# EAGLE design 控制电路 (EAGLE 6.4)
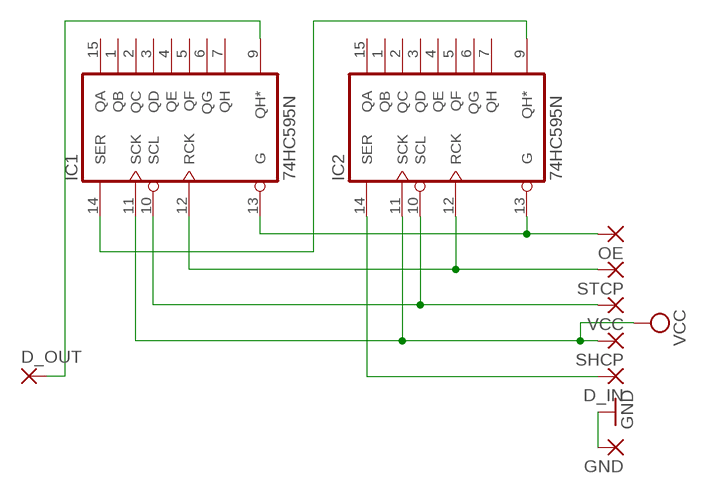
[diagram p0: schematic, sheet 1]

## Parts
D_IN  1,6/0,8  [1,6/0,8]
D_OUT  1,6/0,8  [1,6/0,8]
GND  1,6/0,8  [1,6/0,8]
IC1  74HC595N  [DIL16]
IC2  74HC595N  [DIL16]
OE  1,6/0,8  [1,6/0,8]
SHCP  1,6/0,8  [1,6/0,8]
STCP  1,6/0,8  [1,6/0,8]
VCC  1,6/0,8  [1,6/0,8]

## Nets
GND: GND.1(P)
N$1: IC1.13(G) IC2.13(G) OE.1(P)
N$2: IC1.12(RCK) IC2.12(RCK) STCP.1(P)
N$4: IC1.10(SCL) IC2.10(SCL) VCC.1(P)
N$5: IC1.14(SER) IC2.9(QH*)
N$6: D_IN.1(P) IC2.14(SER)
N$7: D_OUT.1(P) IC1.9(QH*)
VCC: IC1.11(SCK) IC2.11(SCK) SHCP.1(P)
Unconnected: IC1.1(QB) IC1.2(QC) IC1.3(QD) IC1.4(QE) IC1.5(QF) IC1.6(QG) IC1.7(QH) IC1.15(QA) IC2.1(QB) IC2.2(QC) IC2.3(QD) IC2.4(QE) IC2.5(QF) IC2.6(QG) IC2.7(QH) IC2.15(QA)

## Power pins joined to a net without a drawn wire
GND: IC1.8(GND) IC2.8(GND)
VCC: IC1.16(VCC) IC2.16(VCC)

## Library data of the parts
D_IN D_OUT GND OE SHCP STCP VCC = wirepad:1,6/0,8: THROUGH-HOLE PAD
IC1 IC2 = 74xx-eu:74*595: 8-bit SHIFT REGISTER, output latch

## Board
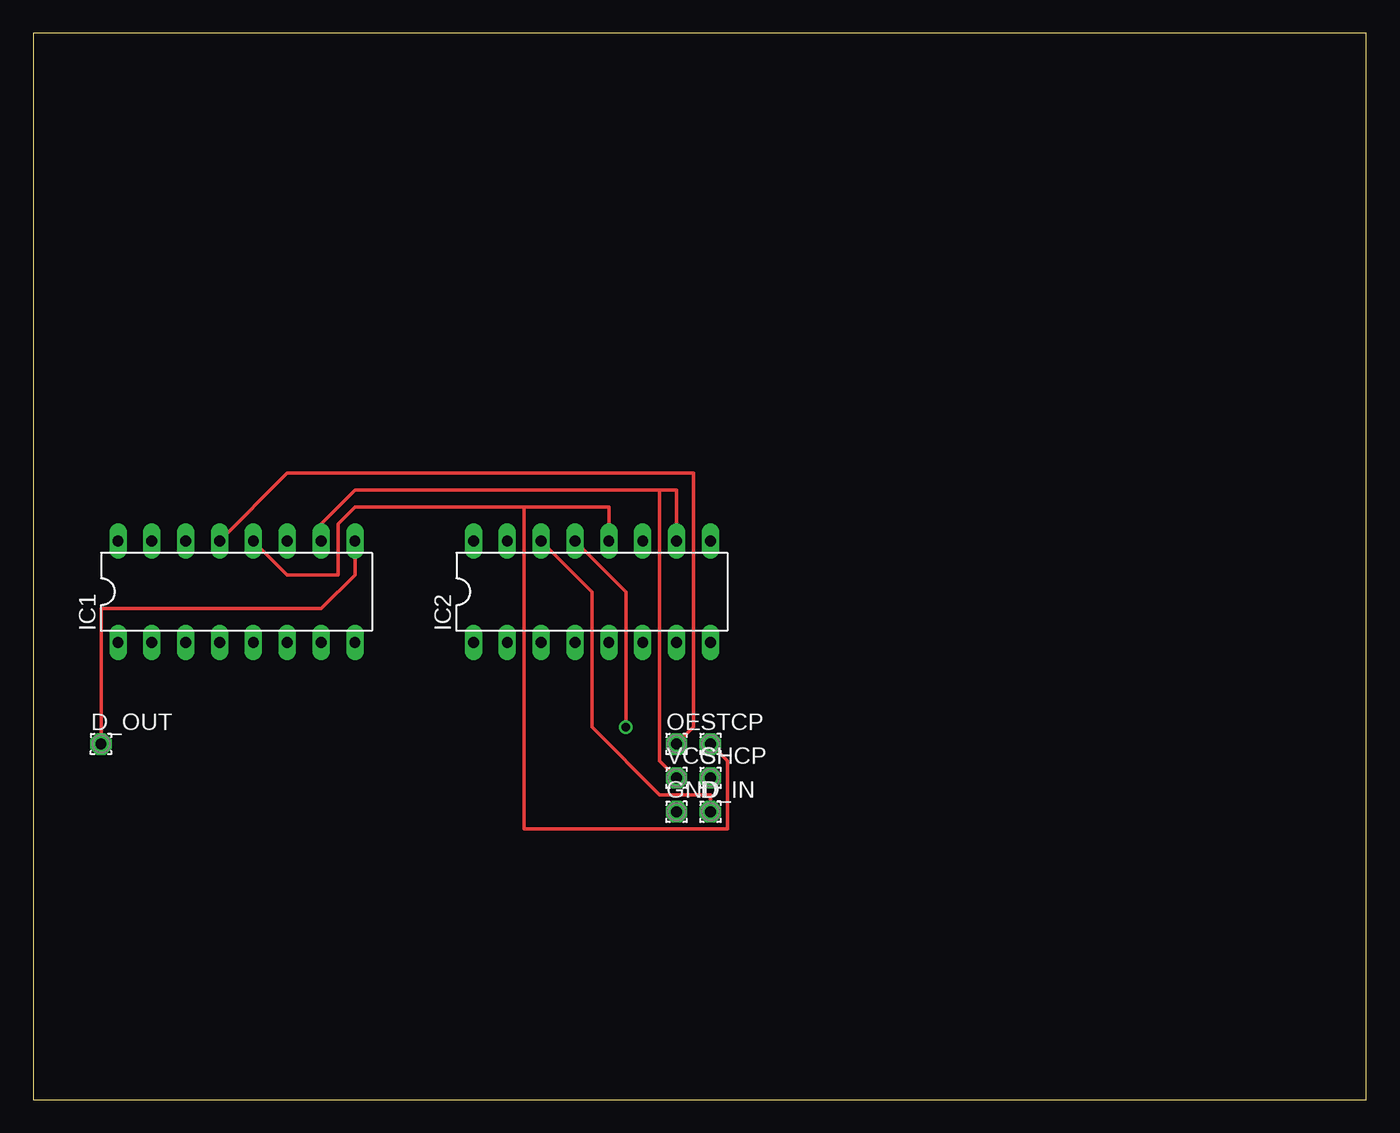
[diagram p1: board, top side]
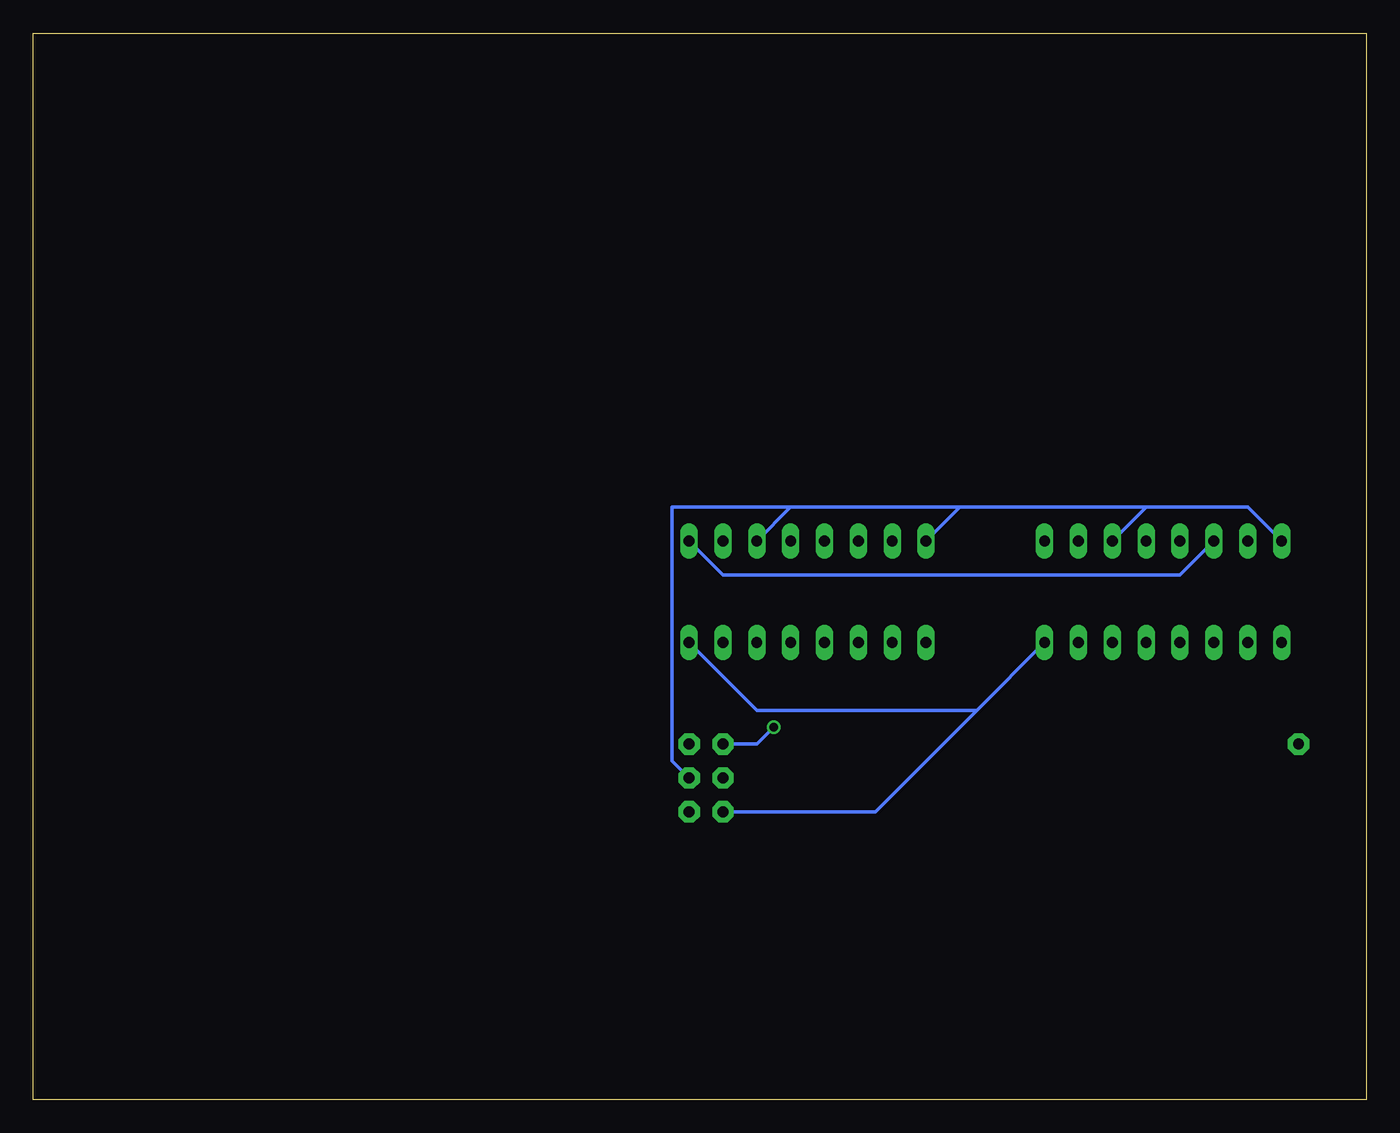
[diagram p2: board, bottom side, seen from below]

Size 100 x 80 mm. Coordinates in mm from the lower left corner, seen from the top.
Outline: 0,0 100,0 100,80 0,80 0,0
Copper layers (1*16): Top 0.035mm / dielectric 1.5mm / Bottom 0.035mm
Design rules "default": minimum track width 10mil, minimum drill 24mil, track to track 8mil, track to pad 8mil, pad to pad 8mil, via to via 8mil, smd to smd 8mil, copper to edge 40mil, drill to drill 8mil, minimum pad ring 10mil, minimum via ring 8mil, stop-mask expansion 4mil, vias tented up to drill 0mil, thermal gap 10mil

### Footprints (pad centres in the part's own frame; a part is rotated, then mirrored left to right if it is on the bottom)
1,6/0,8 = drill 0.813 pad 1.6 octagon: 1 0,0
DIL16 = drill 0.813 long: 1 -8.89,-3.81; 2 -6.35,-3.81; 3 -3.81,-3.81; 4 -1.27,-3.81; 5 1.27,-3.81; 6 3.81,-3.81; 7 6.35,-3.81; 8 8.89,-3.81; 9 8.89,3.81; 10 6.35,3.81; 11 3.81,3.81; 12 1.27,3.81; 13 -1.27,3.81; 14 -3.81,3.81; 15 -6.35,3.81; 16 -8.89,3.81

### Placement (x,y rotation side)
D_IN  50.8,21.59 0 top
D_OUT  5.08,26.67 0 top
GND  48.26,21.59 0 top
IC1  15.24,38.1 0 top
IC2  41.91,38.1 0 top
OE  48.26,26.67 0 top
SHCP  50.8,24.13 0 top
STCP  50.8,26.67 0 top
VCC  48.26,24.13 0 top

### Tracks (layer width: path | path; a pad name or v marks a point on that pad's centre or on a via)
GND
  Bottom 0.254: 29.21,29.21 36.83,21.59 GND.1 | 29.21,29.21 IC1.8 | IC2.8 45.72,29.21 29.21,29.21
N$1  (via drill 0.61)
  Top 0.254: IC1.13 19.05,46.99 49.53,46.99 49.53,27.94 OE.1 | IC2.13 44.45,38.1 v44.45,27.94
  Bottom 0.254: v44.45,27.94 45.72,26.67 OE.1
N$2
  Top 0.254: IC1.12 19.05,39.37 22.86,39.37 22.86,43.18 24.13,44.45 36.83,44.45 | 36.83,44.45 43.18,44.45 IC2.12 | STCP.1 52.07,25.4 52.07,20.32 36.83,20.32 36.83,44.45
N$4
  Top 0.254: IC1.10 21.59,43.18 24.13,45.72 46.99,45.72 | 46.99,45.72 48.26,45.72 IC2.10 | VCC.1 46.99,25.4 46.99,45.72
N$5
  Bottom 0.254: IC1.14 13.97,39.37 48.26,39.37 IC2.9
N$6
  Top 0.254: IC2.14 41.91,38.1 41.91,27.94 46.99,22.86 50.8,22.86 D_IN.1
N$7
  Top 0.254: IC1.9 24.13,39.37 21.59,36.83 5.08,36.83 D_OUT.1
VCC
  Bottom 0.254: IC1.16 8.89,44.45 16.51,44.45 | IC1.11 16.51,44.45 | 30.48,44.45 IC2.16 | 16.51,44.45 30.48,44.45 | 43.18,44.45 IC2.11 | 30.48,44.45 43.18,44.45 | SHCP.1 52.07,25.4 52.07,44.45 43.18,44.45